# Altium schematic sheet [4] - Proximity,Temperature Sensors and OLED.SchDoc: Proximity,Temperature Sensors+OLED
size A4 portrait; ApprovedBy: Team 7; CheckedBy: Charitonidis A.; Author: Charitonidis Alexandros; CompanyName: SMAQ; DrawnBy: Charitonidis A.; Engineer: Charitonidis Alexandros; Organization: SMAQ; Address1: Glasgow; Address3: NSW; DocumentNumber: SCH-003; Revision: 1.1; SheetNumber: 4; SheetTotal: 6; TeamNumber: 7
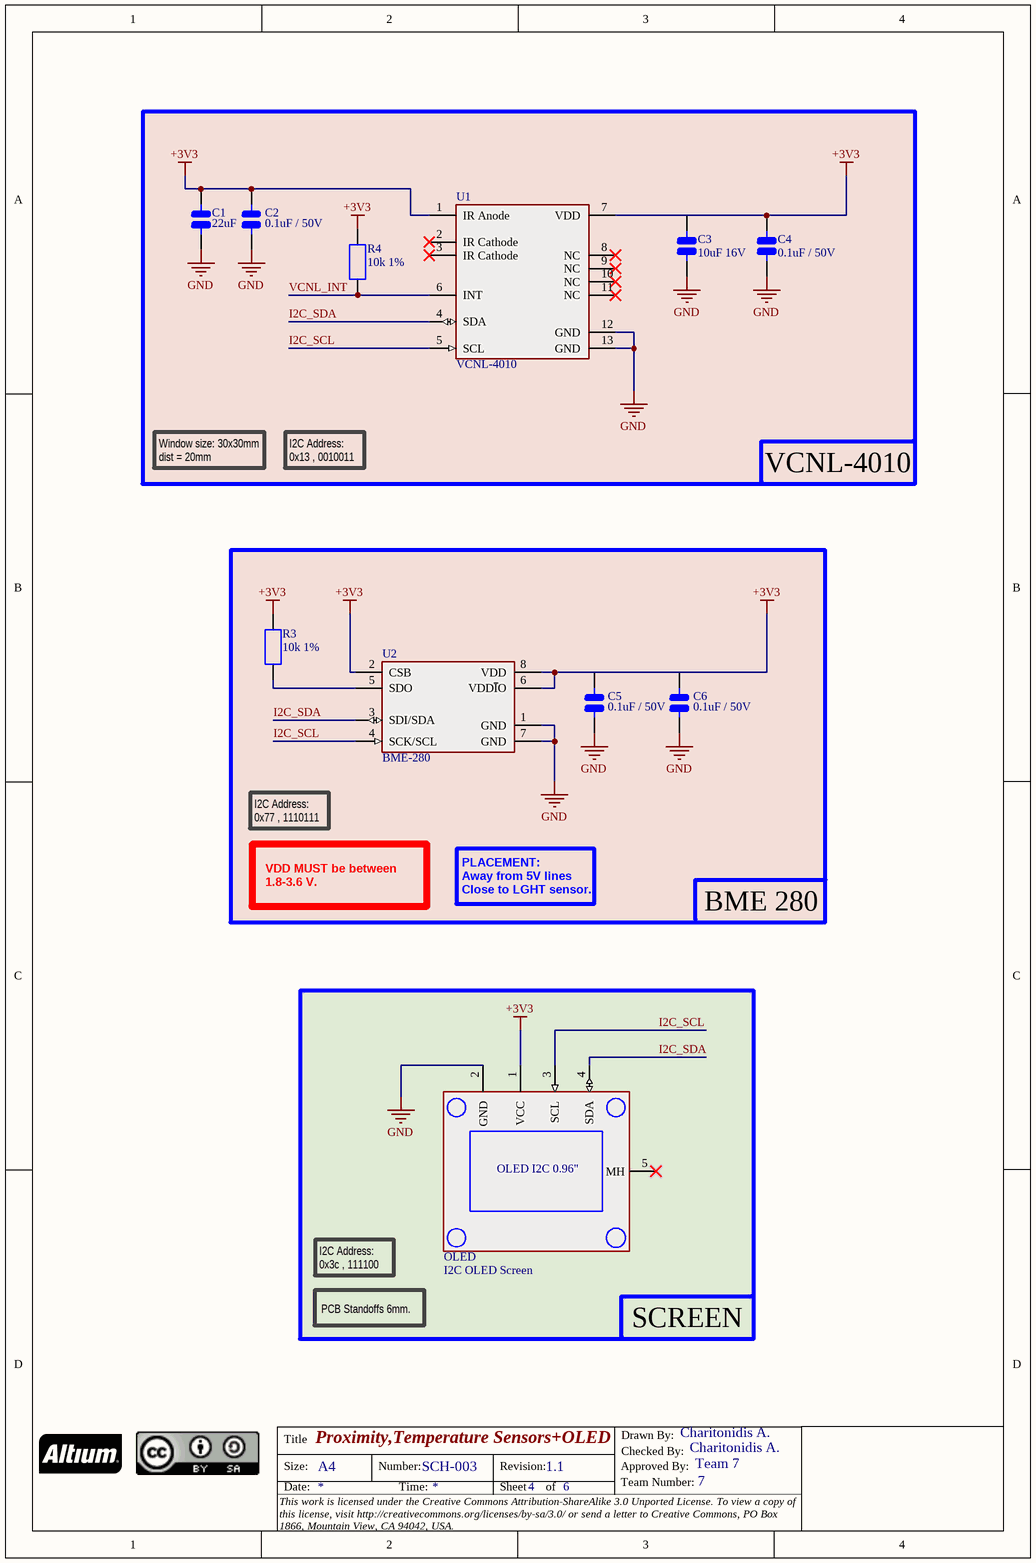
[diagram p0: [4] - Proximity,Temperature Sensors and OLED.SchDoc]

## Parts
C1  22uF  [C0805]  (no BOM)
C2  0.1uF / 50V  [C0805]  (no BOM)
C3  10uF 16V  [C0805]  (no BOM)
C4  0.1uF / 50V  [C0805]  (no BOM)
C5  0.1uF / 50V  [C0805]  (no BOM)
C6  0.1uF / 50V  [C0805]  (no BOM)
OLED  I2C OLED Screen  [OLED_I2C_0.96"]  (no BOM)
R3  10k 1%  [R0805 (2012M)]  (no BOM)
R4  10k 1%  [R0805 (2012M)]  (no BOM)
U1  VCNL-4010  [VCNL-4010]  (no BOM)
U2  BME-280  [LGA_8P_0.65MM]  (no BOM)

## Blocks framed on the sheet
VCNL-4010: C1-C4 R4 U1
BME 280: C5 C6 R3 U2
SCREEN: OLED

## Nets
+3V3: C1.2 C2.2 C3.2 C4.1 C5.2 C6.2 OLED.1(VCC) R3.2 R4.2 U1.1(IR_Anode) U1.7(VDD) U2.2(CSB) U2.6(VDD~{I}O) U2.8(VDD)
GND: C1.1 C2.1 C3.1 C4.2 C5.1 C6.1 OLED.2(GND) U1.12(GND) U1.13(GND) U2.1(GND) U2.7(GND)
I2C_SCL: OLED.3(SCL) U1.5(SCL) U2.4(SCK/SCL)
I2C_SDA: OLED.4(SDA) U1.4(SDA) U2.3(SDI/SDA)
VCNL_INT: R4.1 U1.6(INT)
NetR3_1: R3.1 U2.5(SDO)

Not connected (* = marked no-connect by the designer): OLED 5(MH)*; U1 2(IR_Cathode)* 3(IR_Cathode)* 8(NC)* 9(NC)* 10(NC)* 11(NC)*

## Notes on the sheet
- Window size: 30x30mm dist = 20mm
- I2C Address: 0x13 , 0010011
- I2C Address: 0x77 , 1110111
- VDD MUST be between 1.8-3.6 V.
- PLACEMENT:
  Away from 5V lines
  Close to LGHT sensor.
- I2C Address: 0x3c , 111100
- PCB Standoffs 6mm.
- Title
- Drawn By:
- Size:
- Date:
- A4
- Number:
- Time:
- Revision:
- Sheet
- of
- Approved By:
- Team Number:
- Checked By:
- This work is licensed under the Creative Commons Attribution-ShareAlike 3.0 Unported License. To view a copy of this license, visit http://creativecommons.org/licenses/by-sa/3.0/ or send a letter to Creative Commons, PO Box 1866, Mountain View, CA 94042, USA.
- (in symbol OLED_I2C_BREAKOUT) OLED I2C 0.96"

## Library data of the parts
C1 = C2012JB1A226M085AC: CAP CER 22UF 10V JB 0805; Manufacturer 1: TDK; Category 1: Ceramic Capacitors; Dielectric Material: Ceramic; Tolerance: 20%; Supplier 1: Mouser; Manufacturer Part Number 1: C2012JB1A226M085AC; RoHS: Yes; Description 1: CAP CER 22UF 10V JB 0805; Stock 1: 10381; Mount: Surface Mount; Case/Package: 0805; Case Code (Metric): 2012; Case Code (Imperial): 0805; Min Operating Temperature: -25°C; Max Operating Temperature: 85°C; Package Quantity: 1; Packaging: Tape and Reel; Capacitance: 22uF; Voltage Rating: 10V; Termination: SMD/SMT; Composition: Ceramic; Voltage Rating (DC): 10V; Length: 0.079inch; Height: 0.85mm; Width: 1.2mm; Thickness: 0.039inch; Lead Free: Lead Free; ComponentLink1URL: https://datasheet.ciiva.com/14908/tdkmlcccaprange-14908199.pdf?src-supplier=Digi-Key; ComponentLink1Description: https://datasheet.ciiva.com/14908/tdkmlcccaprange-14908199.pdf?src-supplier=Digi-Key; ComponentLink2URL: https://datasheet.ciiva.com/14908/tdkmlcccaprange-14908201.pdf?src-supplier=Digi-Key; ComponentLink2Description: https://datasheet.ciiva.com/14908/tdkmlcccaprange-14908201.pdf?src-supplier=Digi-Key; Supplier Part Number 1: 810-C2012JB1A226M08C
C2 C4-C6 = 08055C104JAT4A: CAP CER 0.1UF 50V X7R 0805; Manufacturer 1: Kyocera AVX; Category 1: Ceramic Capacitors; Capacitance: 100nF; Tolerance: 5%; Supplier 1: Mouser; Manufacturer Part Number 1: 08055C104JAT4A; RoHS: Yes; Description 1: CAP CER 0.1UF 50V X7R 0805; Stock 1: 70357; Mount: Surface Mount; Case/Package: 0805; Number of Pins: 2; Case Code (Imperial): 0805; Case Code (Metric): 2012; Min Operating Temperature: -55°C; Max Operating Temperature: 125°C; Dielectric: X7R; Package Quantity: 10000; Voltage Rating: 50V; Packaging: Tape and Reel; Termination: SMD/SMT; Voltage Rating (DC): 50V; Length: 2.01mm; Depth: 1.25mm; Width: 0.049inch; Thickness: 0.037inch; Radiation Hardening: No; Lead Free: Lead Free; ComponentLink1URL: https://datasheet.ciiva.com/16326/cx7r-16326437.pdf?src-supplier=Future+Electronics; ComponentLink1Description: https://datasheet.ciiva.com/16326/cx7r-16326437.pdf?src-supplier=Future+Electronics; ComponentLink2URL: https://datasheet.ciiva.com/6277/cx7r-6277722.pdf?src-supplier=Digi-Key; ComponentLink2Description: https://datasheet.ciiva.com/6277/cx7r-6277722.pdf?src-supplier=Digi-Key; Supplier Part Number 1: 581-08055C104JAT4A
C3 = 0805YC106MAT2A: Manufacturer 1: Kyocera AVX; Supplier 1: Mouser; Manufacturer Part Number 1: 0805YC106MAT2A; RoHS: No; Stock 1: 1756; Supplier Part Number 1: 581-0805YC106MAT2A
OLED = OLED_I2C_BREAKOUT
R3 R4 = AT0805FRE0710KL: RES SMD 10K OHM 1% 1/8W 0805; Manufacturer 1: Yageo; Category 1: Chip SMD Resistors; Resistance: 10kR; Max Power Dissipation: 125mW; Temperature Coefficient: 50ppm/°C; Supplier 1: Mouser; Manufacturer Part Number 1: AT0805FRE0710KL; RoHS: Yes; Description 1: RES SMD 10K OHM 1% 1/8W 0805; Stock 1: 12821; Case/Package: 0805; Case Code (Metric): 2012; Case Code (Imperial): 0805; Min Operating Temperature: -55°C; Max Operating Temperature: 155°C; Packaging: Tape and Reel; Composition: Thin Film; Number of Terminations: 2; Tolerance: 1%; Features: Moisture Resistant,Automotive AEC-Q200,Anti-Sulfur; Length: 0.079inch; Height: 0.024inch; Width: 0.049inch; ComponentLink1URL: http://www.yageo.com/documents/recent/PYu-AT_51_RoHS_L_5.pdf?src-supplier=Digi-Key; ComponentLink1Description: http://www.yageo.com/documents/recent/PYu-AT_51_RoHS_L_5.pdf?src-supplier=Digi-Key; ComponentLink2URL: http://www.yageo.com/documents/recent/PYu-AT_51_RoHS_L-3.pdf?src-supplier=Digi-Key; ComponentLink2Description: http://www.yageo.com/documents/recent/PYu-AT_51_RoHS_L-3.pdf?src-supplier=Digi-Key; Supplier Part Number 1: 603-AT0805FRE0710KL
U1 = VCNL4010-GS08: SENS IR PROXIMITY AMB LT 12LLP; Manufacturer 1: Vishay Semiconductors; Category 1: Sensors; Operating Supply Voltage: 3.3V; Number of Channels: 1; Wavelength: 892nm; Min Supply Voltage: 2.5V; Max Supply Voltage: 3.6V; Sensing Distance: 200mm; Power Dissipation: 50mW; Output Type: I2C,Digital; Sensing Method: Optical; Output Configuration: Digital; Supplier 1: Mouser; Manufacturer Part Number 1: VCNL4010-GS08; RoHS: Yes; Description 1: SENS IR PROXIMITY AMB LT 12LLP; Stock 1: 15561; Mount: Surface Mount; Case/Package: SMD/SMT; Number of Pins: 13; Min Operating Temperature: -25°C; Max Operating Temperature: 85°C; Packaging: Tape and Reel; Package Quantity: 1800; Length: 3.95mm; Height: 0.75mm; Width: 3.95mm; Radiation Hardening: No; REACH SVHC: Unknown; Lead Free: Lead Free; ComponentLink1URL: https://datasheet.ciiva.com/4626/vcnl4010-97030-4626352.pdf?src-supplier=Mouser; ComponentLink1Description: https://datasheet.ciiva.com/4626/vcnl4010-97030-4626352.pdf?src-supplier=Mouser; ComponentLink2URL: https://datasheet.ciiva.com/7617/vcnl4010-7617985.pdf?src-supplier=Element14; ComponentLink2Description: https://datasheet.ciiva.com/7617/vcnl4010-7617985.pdf?src-supplier=Element14; ComponentLink3URL: https://datasheet.ciiva.com/15230/vcnl4010-15230062.pdf?src-supplier=Arrow+Europe; ComponentLink3Description: https://datasheet.ciiva.com/15230/vcnl4010-15230062.pdf?src-supplier=Arrow+Europe; ComponentLink4URL: https://datasheet.ciiva.com/16225/vcnl4010-16225925.pdf?src-supplier=Future+Electronics; ComponentLink4Description: https://datasheet.ciiva.com/16225/vcnl4010-16225925.pdf?src-supplier=Future+Electronics; ComponentLink5URL: https://datasheet.ciiva.com/14650/vcnl4010-14650582.pdf?src-supplier=Element14; ComponentLink5Description: https://datasheet.ciiva.com/14650/vcnl4010-14650582.pdf?src-supplier=Element14; ComponentLink6URL: https://datasheet.ciiva.com/2819/vcnl4010-2819260.pdf?src-supplier=Digi-Key; ComponentLink6Description: https://datasheet.ciiva.com/2819/vcnl4010-2819260.pdf?src-supplier=Digi-Key; ComponentLink7URL: https://datasheet.ciiva.com/2819/vcnl4010-2819261.pdf?src-supplier=Digi-Key; ComponentLink7Description: https://datasheet.ciiva.com/2819/vcnl4010-2819261.pdf?src-supplier=Digi-Key; ComponentLink8URL: https://datasheet.ciiva.com/25912/vcnl4010-25912077.pdf?src-supplier=Avnet+Europe; ComponentLink8Description: https://datasheet.ciiva.com/25912/vcnl4010-25912077.pdf?src-supplier=Avnet+Europe; ComponentLink9URL: https://datasheet.ciiva.com/2819/vcnl4010-2819262.pdf?src-supplier=Digi-Key; ComponentLink9Description: https://datasheet.ciiva.com/2819/vcnl4010-2819262.pdf?src-supplier=Digi-Key; ComponentLink10URL: https://datasheet.ciiva.com/3275/vcnl4010-3275278.pdf?src-supplier=Avnet; ComponentLink10Description: https://datasheet.ciiva.com/3275/vcnl4010-3275278.pdf?src-supplier=Avnet; Supplier Part Number 1: 78-VCNL4010-GS08
U2 = BME280: Pressure, Temperature and Humidity Sensor Digital Output 1.8V 8-Pin LGA T/R; Manufacturer 1: Bosch; Category 1: Pressure Sensors; Manufacturer Part Number 1: BME280; RoHS: No; Description 1: Pressure, Temperature and Humidity Sensor Digital Output 1.8V 8-Pin LGA T/R; Stock 1: 22089; Case/Package: LGA; Number of Pins: 8; Lead Free: Lead Free; ComponentLink1URL: https://ae-bst.resource.bosch.com/media/_tech/media/product_flyer/BME280_Productflyer_BST_20170109.pdf?src-supplier=Future+Electronics; ComponentLink1Description: https://ae-bst.resource.bosch.com/media/_tech/media/product_flyer/BME280_Productflyer_BST_20170109.pdf?src-supplier=Future+Electronics; ComponentLink2URL: https://ae-bst.resource.bosch.com/media/_tech/media/datasheets/BST-BME280-DS002.pdf?src-supplier=Digi-Key; ComponentLink2Description: https://ae-bst.resource.bosch.com/media/_tech/media/datasheets/BST-BME280-DS002.pdf?src-supplier=Digi-Key; ComponentLink3URL: https://ae-bst.resource.bosch.com/media/_tech/media/product_flyer/BME280_Productflyer_BST_20170109.pdf?src-supplier=Arrow; ComponentLink3Description: https://ae-bst.resource.bosch.com/media/_tech/media/product_flyer/BME280_Productflyer_BST_20170109.pdf?src-supplier=Arrow; ComponentLink4URL: https://ae-bst.resource.bosch.com/media/_tech/media/product_flyer/BME280_Productflyer_BST_20170109.pdf?src-supplier=Mouser; ComponentLink4Description: https://ae-bst.resource.bosch.com/media/_tech/media/product_flyer/BME280_Productflyer_BST_20170109.pdf?src-supplier=Mouser; ComponentLink5URL: https://ae-bst.resource.bosch.com/media/_tech/media/product_flyer/BME280_Productflyer_BST_20170109.pdf?src-supplier=Rutronik; ComponentLink5Description: https://ae-bst.resource.bosch.com/media/_tech/media/product_flyer/BME280_Productflyer_BST_20170109.pdf?src-supplier=Rutronik; ComponentLink6URL: https://ae-bst.resource.bosch.com/media/_tech/media/product_flyer/BME280_Productflyer_BST_20170109.pdf?src-supplier=NAC+Semi; ComponentLink6Description: https://ae-bst.resource.bosch.com/media/_tech/media/product_flyer/BME280_Productflyer_BST_20170109.pdf?src-supplier=NAC+Semi; Supplier 1: Mouser; Supplier Part Number 1: 262-BME280